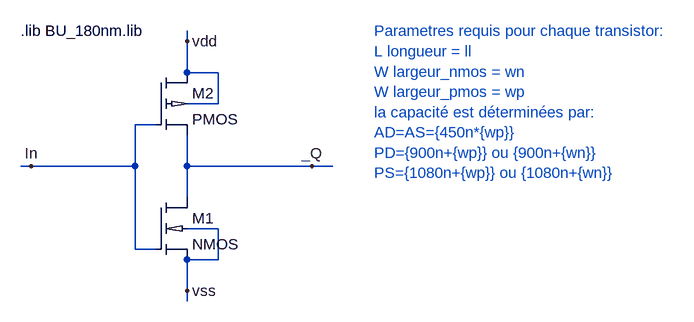
[diagram p0: schematic Inv.asc]
Inv.asc, the LTspice schematic file:
Version 4
SHEET 1 1192 680
WIRE 448 176 448 160
WIRE 448 224 448 176
WIRE 496 224 448 224
WIRE 496 272 496 224
WIRE 496 272 448 272
WIRE 400 304 368 304
WIRE 208 368 192 368
WIRE 368 368 368 304
WIRE 368 368 208 368
WIRE 448 368 448 320
WIRE 640 368 448 368
WIRE 672 368 640 368
WIRE 448 416 448 368
WIRE 496 464 448 464
WIRE 368 496 368 368
WIRE 400 496 368 496
WIRE 496 512 496 464
WIRE 496 512 448 512
WIRE 448 560 448 512
WIRE 448 576 448 560
FLAG 448 176 vdd
FLAG 448 560 vss
FLAG 640 368 _Q
FLAG 208 368 In
SYMBOL nmos018 400 416 R0
SYMATTR InstName M1
SYMATTR Value2 l={ll} w={wn} ad={450n*{wn}} as={450n*{wn}} pd={900n+{wn}} ps={1080n+{wn}}
SYMBOL pmos018 400 224 R0
SYMATTR InstName M2
SYMATTR Value2 l={ll} w={wp} ad={450n*{wp}} as={450n*{wp}} pd={900n+{wp}} ps={1080n+{wp}}
TEXT 192 160 Left 2 !.lib BU_180nm.lib
TEXT 736 160 Left 2 ;Parametres requis pour chaque transistor: \nL longueur = ll \nW largeur_nmos = wn\nW largeur_pmos = wp\nla capacité est déterminées par:\nAD=AS={450n*{wp}}\nPD={900n+{wp}} ou {900n+{wn}}\nPS={1080n+{wp}} ou {1080n+{wn}}

The netlist it stands for:
* Inv.asc
M1 _Q In vss vss NMOS l={ll} w={wn} ad={450n*{wn}} as={450n*{wn}} pd={900n+{wn}} ps={1080n+{wn}}
M2 vdd In _Q vdd PMOS l={ll} w={wp} ad={450n*{wp}} as={450n*{wp}} pd={900n+{wp}} ps={1080n+{wp}}
.model NMOS NMOS
.model PMOS PMOS
.lib standard.mos
.lib BU_180nm.lib
* Parametres requis pour chaque transistor:
* L longueur = ll
* W largeur_nmos = wn
* W largeur_pmos = wp
* la capacité est déterminées par:
* AD=AS={450n*{wp}}
* PD={900n+{wp}} ou {900n+{wn}}
* PS={1080n+{wp}} ou {1080n+{wn}}
.lib BU_180nm.lib
.backanno
.end